# EAGLE schematic WPSU (EAGLE 9.4.2)

## Sheet 1 of 6: Battery
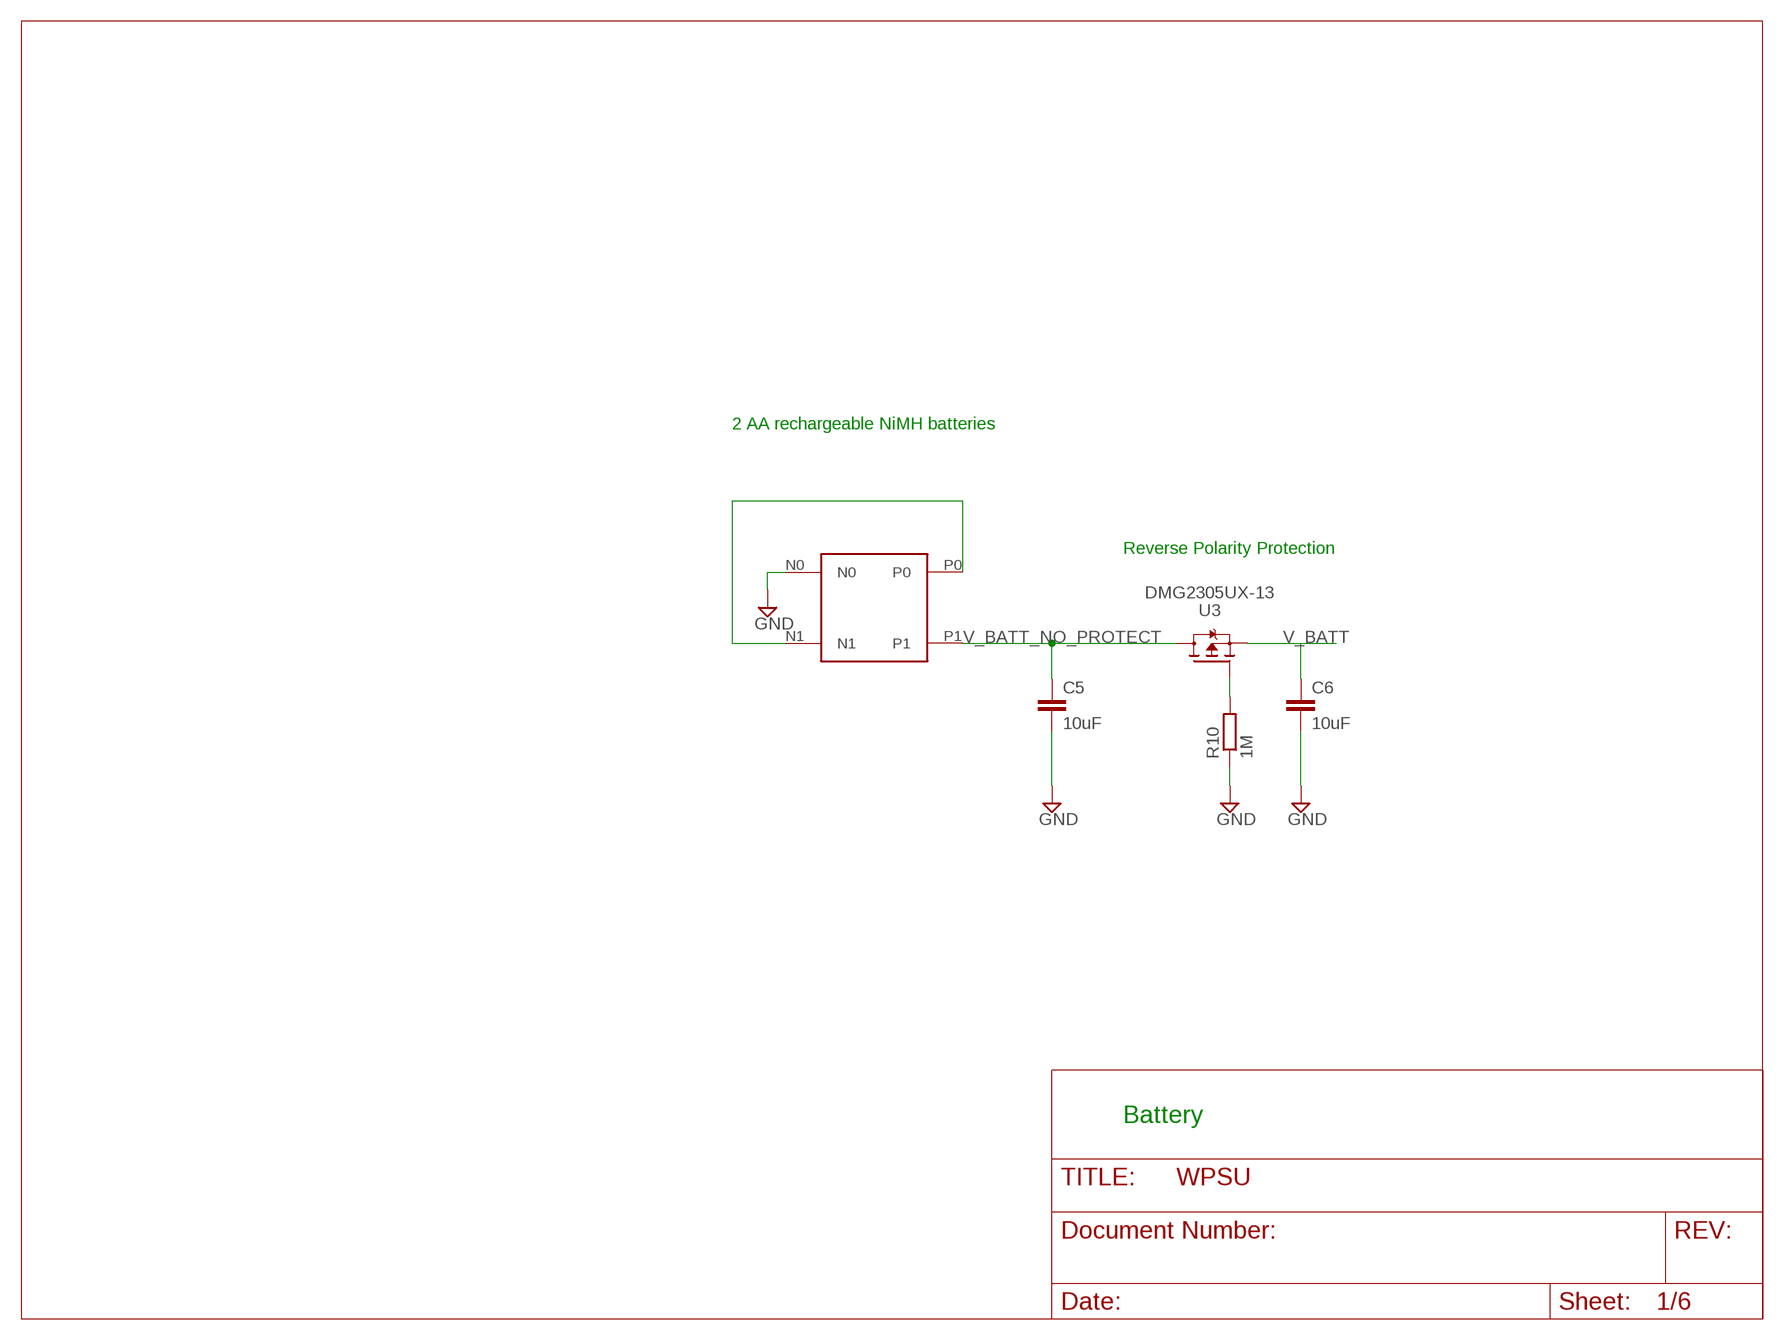
[diagram p0: schematic, sheet 1]

### Parts
C5  10uF  C-EUC0603  [C0603]
C6  10uF  C-EUC0603  [C0603]
R10  1M  R-EU_R0603  [R0603]
U3  DMG2305UX-13  [SOT-23]
U$1  2AA-BATTERY-HOLDER  [2AA-BATTERY-HOLDER-FOOTPRINT]

### Nets
GND: C5.2 C6.2 R10.1 U$1.N0 ; also sheet 2,3,4,5,6
N$7: U$1.N1 U$1.P0
N$8: R10.2 U3.1(G)
V_BATT: U3.2(S) ; also sheet 3
V_BATT_NO_PROTECT: C5.1 U3.3(D) U$1.P1
V_BATT_NO_PROTECT1: C6.1

### Notes on the sheet
- 2 AA rechargeable NiMH batteries
- Reverse Polarity Protection
- Battery

## Sheet 2 of 6: USB
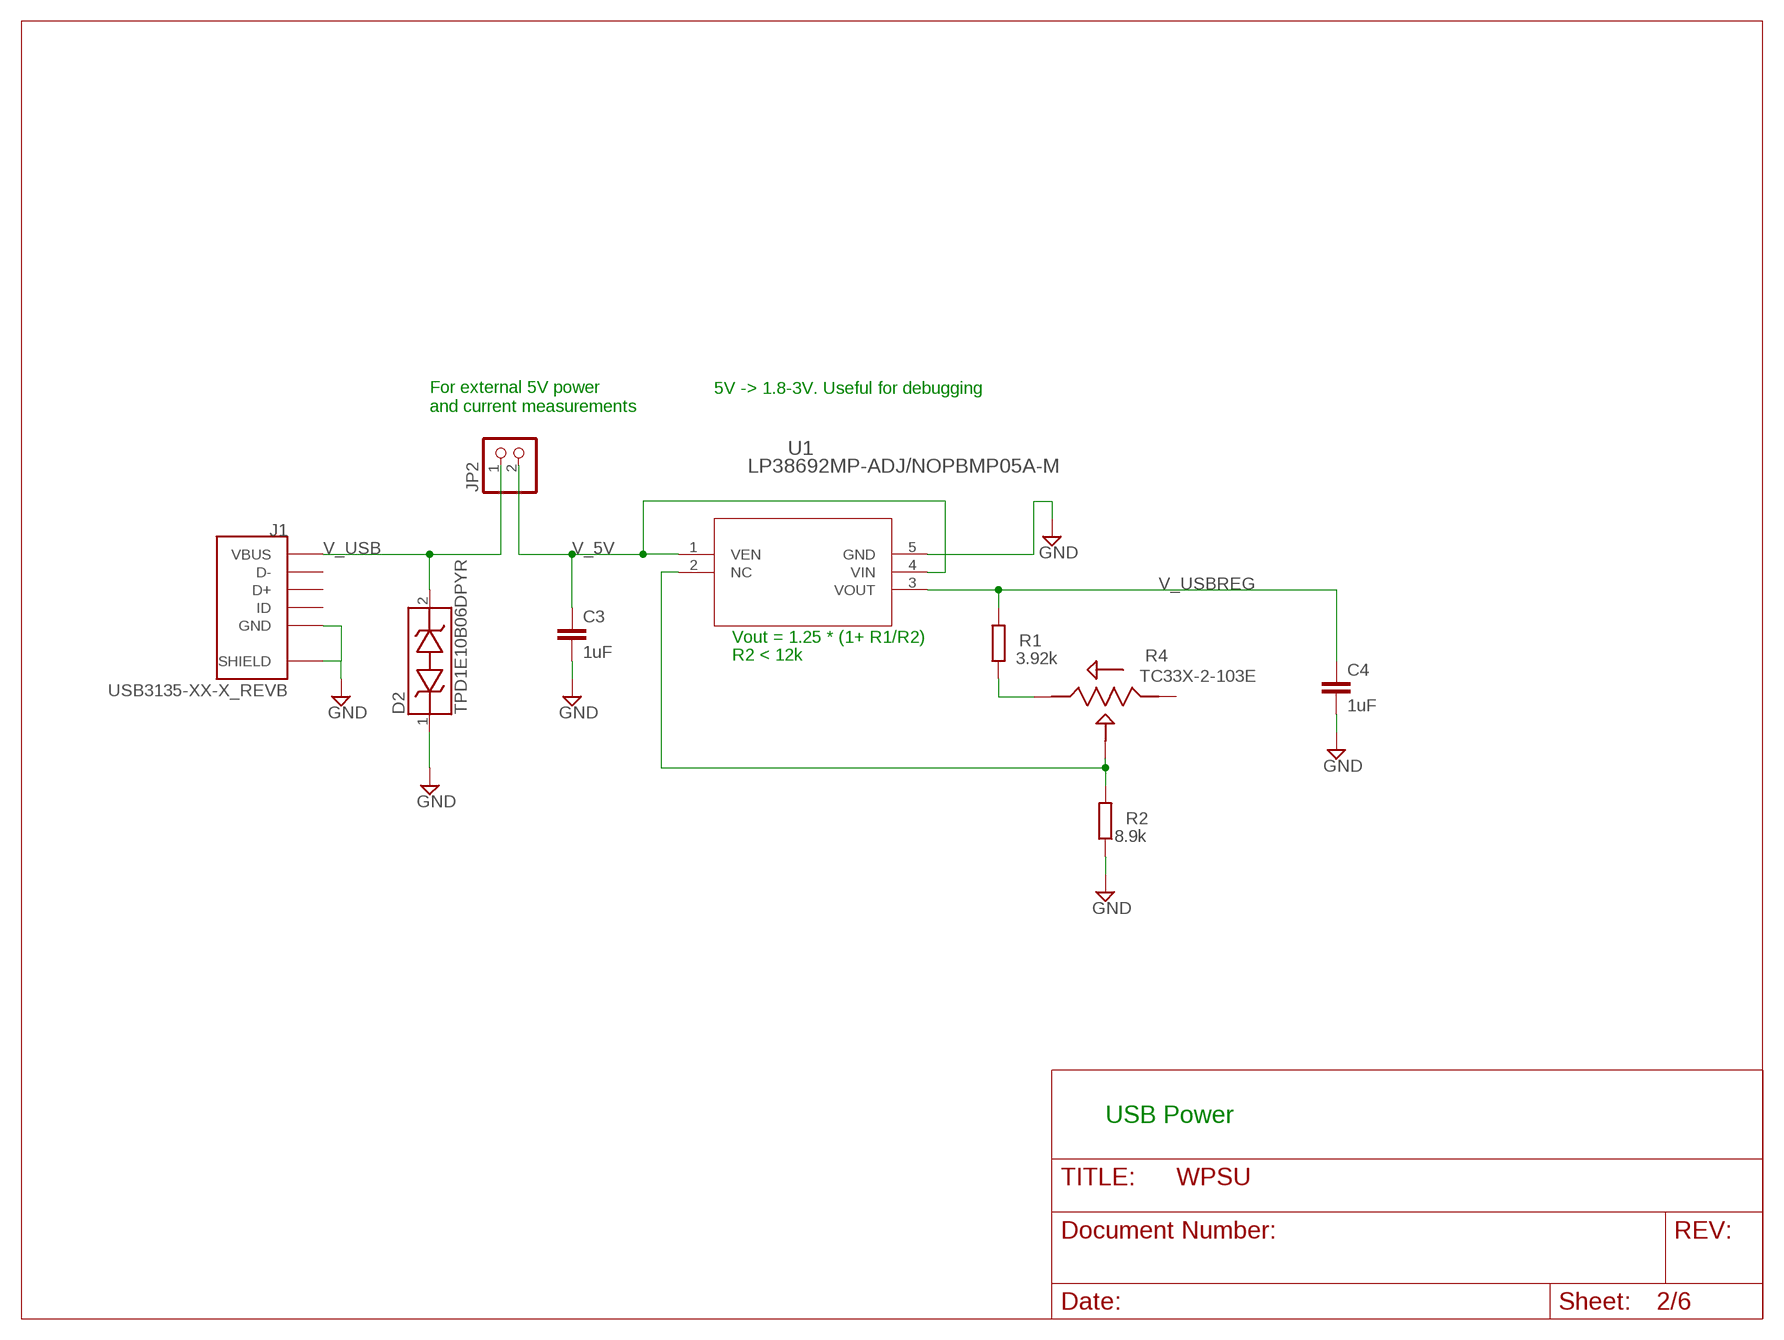
[diagram p1: schematic, sheet 2]

### Parts
C3  1uF  C-EUC0603  [C0603]
C4  1uF  C-EUC0603  [C0603]
D2  TPD1E10B06DPYR  [DIODFN100X60X45-2N]
J1  USB3135-XX-X_REVB  [GCT_USB3135-XX-X_REVB]
JP2  PINHD-1X2  [1X02]
R1  3.92k  R-EU_R0603  [R0603]
R2  8.9k  R-EU_R0603  [R0603]
R4  TC33X-2-103E  [35WR]
U1  LP38692MP-ADJ/NOPBMP05A-M  [MP05A-M]

### Nets
GND: C3.2 C4.2 D2.1 R2.1 U1.5(GND) ; also sheet 1,3,4,5,6
N$1: R2.2 R4.2 U1.2(NC)
N$2: R1.1 R4.3
N$5: J1.5(GND) J1.6(SHIELD) J1.7(SHIELD) J1.8(SHIELD) J1.9(SHIELD) ; supply symbol labelled GND
V_5V: C3.1 JP2.2 U1.1(VEN) U1.4(VIN)
V_USB: D2.2 J1.1(VBUS) JP2.1
V_USBREG: C4.1 R1.2 U1.3(VOUT) ; also sheet 3
Unconnected: J1.2(D-) J1.3(D+) J1.4(ID) R4.1

### Notes on the sheet
- 5V -> 1.8-3V. Useful for debugging
- For external 5V power
  and current measurements
- Vout = 1.25 * (1+ R1/R2)
- R2 < 12k
- USB Power

## Sheet 3 of 6: Power Regulation
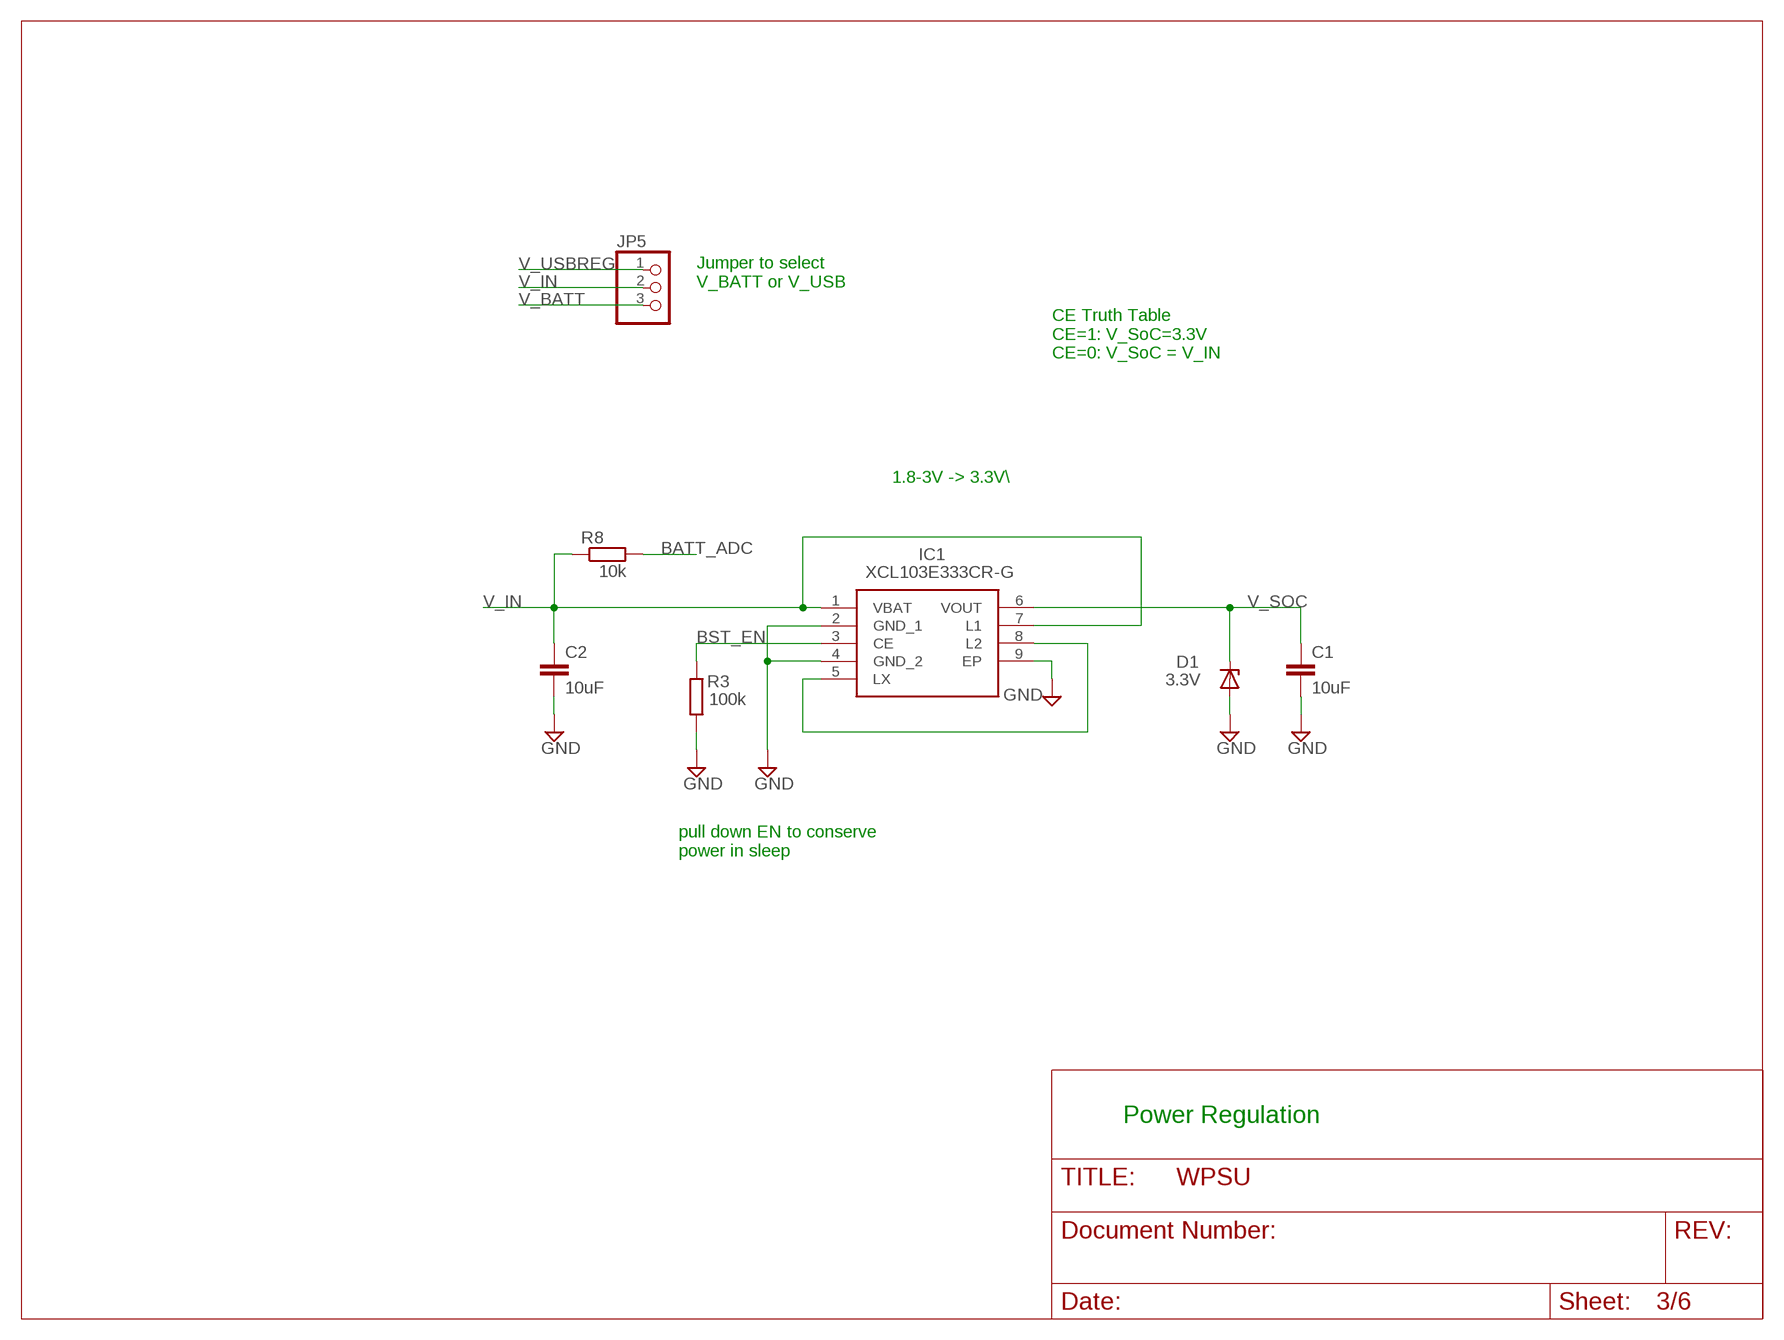
[diagram p2: schematic, sheet 3]

### Parts
C1  10uF  C-EUC0603  [C0603]
C2  10uF  C-EUC0603  [C0603]
D1  3.3V  ZENER-DIODESOT23  [SOT23]
IC1  XCL103E333CR-G  [XCL103D503CRG]
JP5  PINHD-1X3  [1X03]
R3  100k  R-EU_R0603  [R0603]
R8  10k  R-EU_R0603  [R0603]

### Nets
BATT_ADC: R8.2 ; also sheet 4
BST_EN: IC1.3(CE) R3.1 ; also sheet 4
GND: C1.2 C2.2 D1.1(A) IC1.2(GND_1) IC1.4(GND_2) IC1.9(EP) R3.2 ; also sheet 1,2,4,5,6
N$3: IC1.5(LX) IC1.8(L2)
V_BATT: JP5.3 ; also sheet 1
V_IN: C2.1 IC1.1(VBAT) IC1.7(L1) JP5.2 R8.1
V_SOC: C1.1 D1.3(C) IC1.6(VOUT) ; also sheet 4,5,6
V_USBREG: JP5.1 ; also sheet 2

### Notes on the sheet
- Jumper to select
  V_BATT or V_USB
- CE Truth Table
  CE=1: V_SoC=3.3V
  CE=0: V_SoC = V_IN
- 1.8-3V -> 3.3V\
- pull down EN to conserve 
  power in sleep
- Power Regulation

## Sheet 4 of 6: SoC Headers
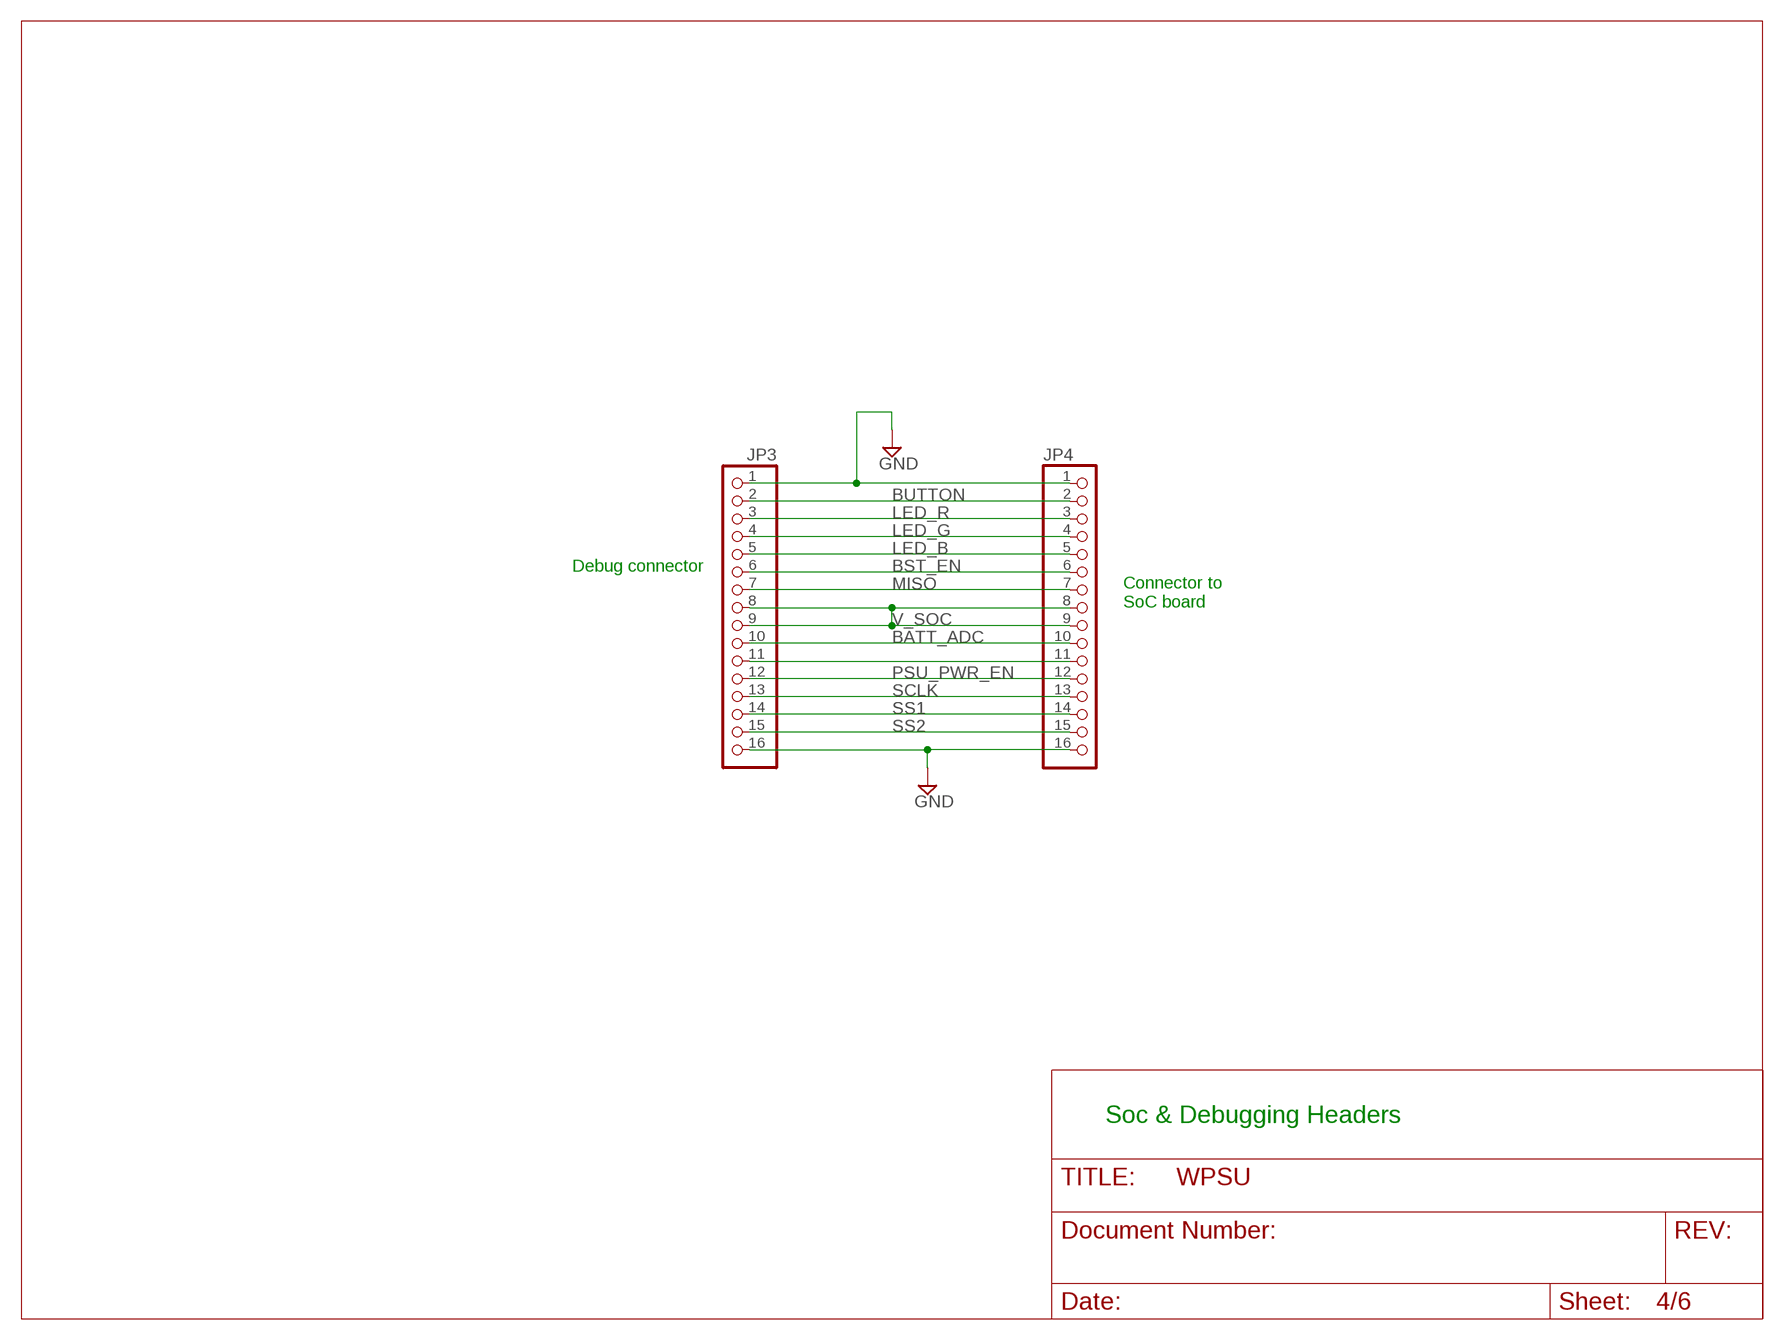
[diagram p3: schematic, sheet 4]

### Parts
JP3  PINHD-1X16  [1X16]
JP4  PINHD-1X16  [1X16]

### Nets
BATT_ADC: JP3.10 JP4.10 ; also sheet 3
BST_EN: JP3.6 JP4.6 ; also sheet 3
BUTTON: JP3.2 JP4.2 ; also sheet 5
GND: JP3.1 JP4.1 ; also sheet 1,2,3,5,6
LED_B: JP3.5 JP4.5 ; also sheet 5
LED_G: JP3.4 JP4.4 ; also sheet 5
LED_R: JP3.3 JP4.3 ; also sheet 5
MISO: JP3.7 JP4.7 ; also sheet 6
N$4: JP3.11 JP4.11
N$16: JP3.16 JP4.16 ; supply symbol labelled GND
PSU_PWR_EN: JP3.12 JP4.12 ; also sheet 6
SCLK: JP3.13 JP4.13 ; also sheet 6
SS1: JP3.14 JP4.14 ; also sheet 6
SS2: JP3.15 JP4.15 ; also sheet 6
V_SOC: JP3.8 JP3.9 JP4.8 JP4.9 ; also sheet 3,5,6

### Notes on the sheet
- Debug connector
- Connector to
  SoC board
- Soc & Debugging Headers

## Sheet 5 of 6: Misc
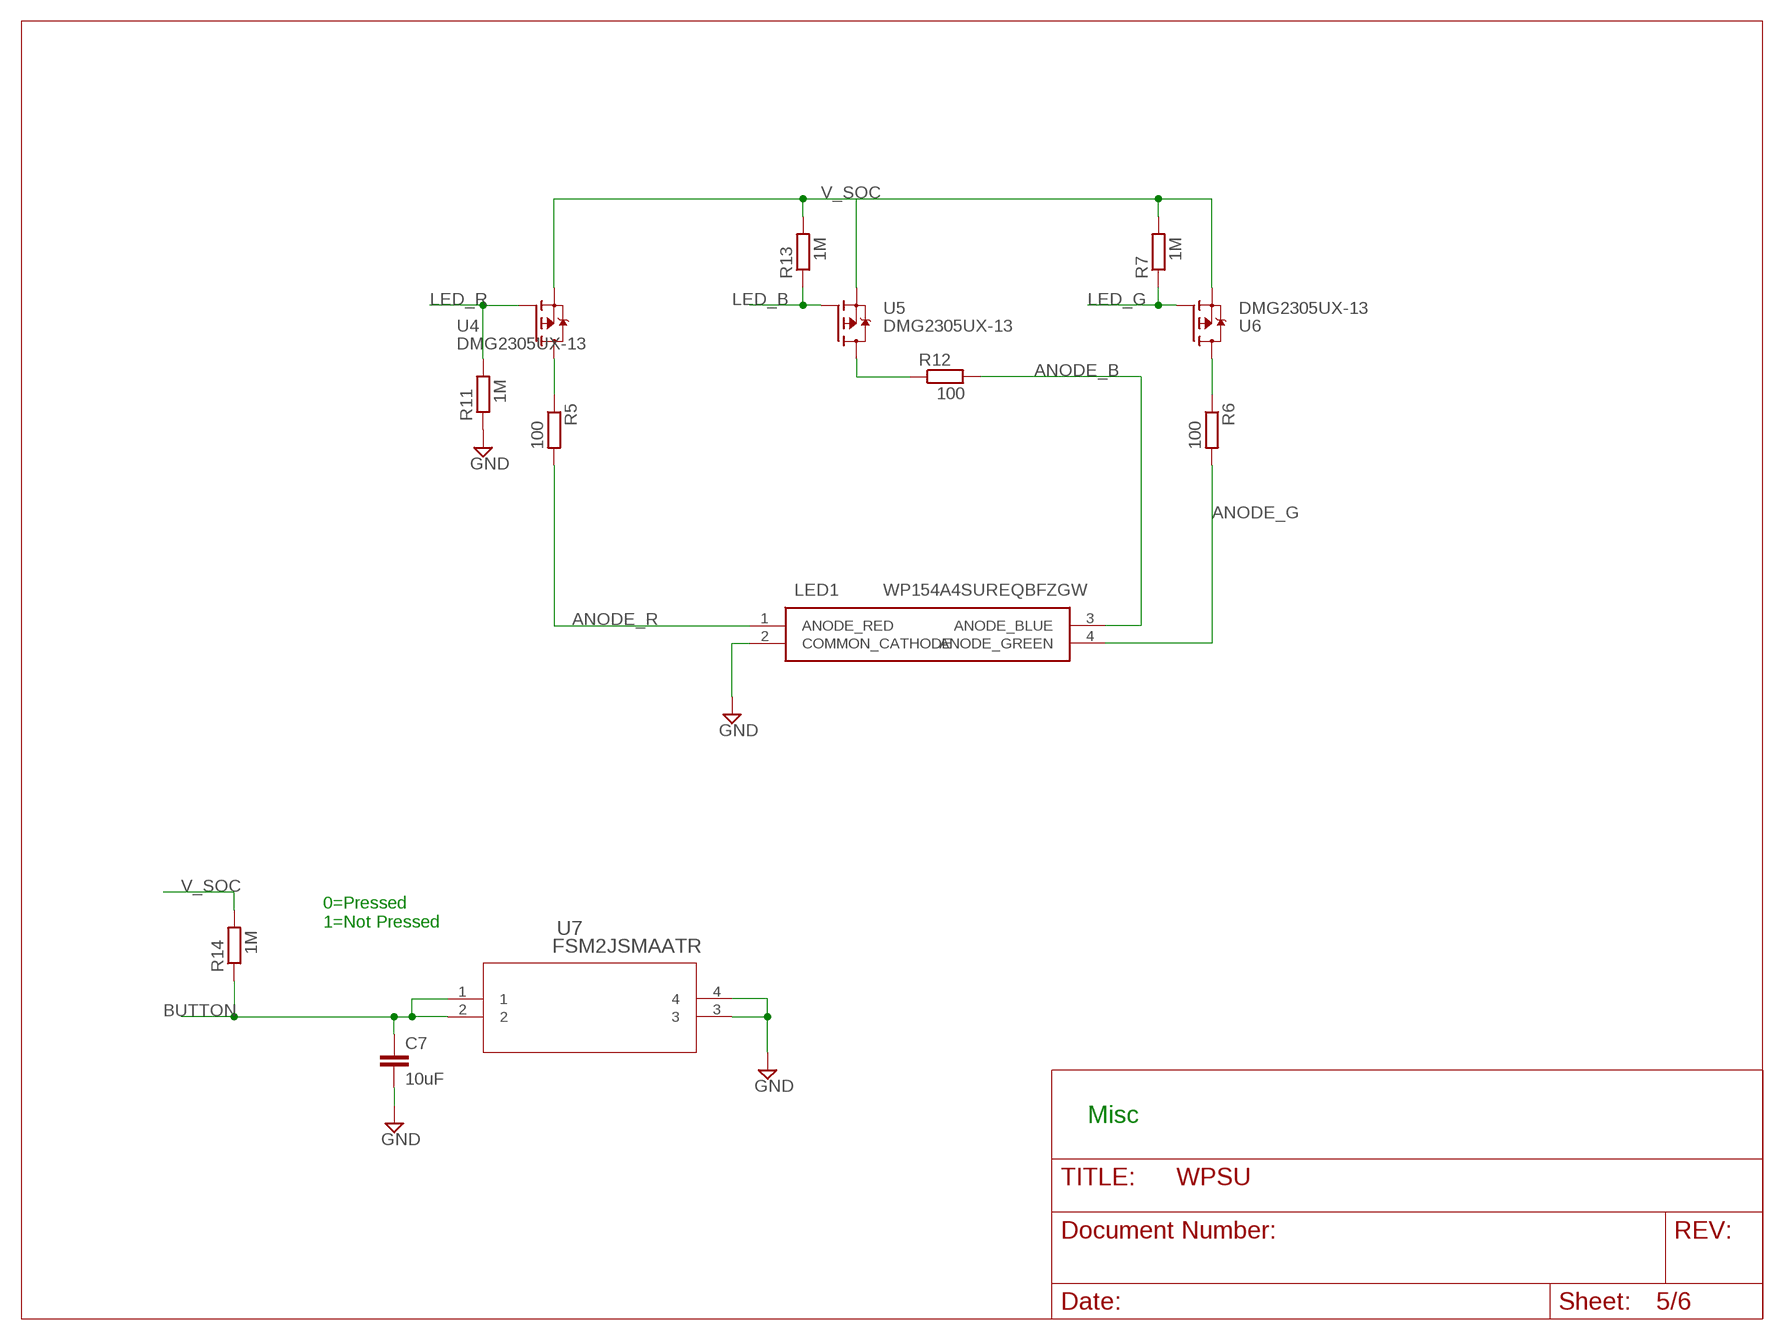
[diagram p4: schematic, sheet 5]

### Parts
C7  10uF  C-EUC0603  [C0603]
LED1  WP154A4SUREQBFZGW  [L-154A4SUREQBFZGEC]
R5  100  R-EU_R0603  [R0603]
R6  100  R-EU_R0603  [R0603]
R7  1M  R-EU_R0603  [R0603]
R11  1M  R-EU_R0603  [R0603]
R12  100  R-EU_R0603  [R0603]
R13  1M  R-EU_R0603  [R0603]
R14  1M  R-EU_R0603  [R0603]
U4  DMG2305UX-13  [SOT-23]
U5  DMG2305UX-13  [SOT-23]
U6  DMG2305UX-13  [SOT-23]
U7  FSM2JSMAATR  [SWITCH_FSM2JSMAA]

### Nets
ANODE_B: LED1.3(ANODE_BLUE) R12.2
ANODE_G: LED1.4(ANODE_GREEN) R6.2
ANODE_R: LED1.1(ANODE_RED) R5.2
BUTTON: C7.1 R14.1 U7.1 U7.2 ; also sheet 4
GND: C7.2 LED1.2(COMMON_CATHODE) R11.1 U7.3 U7.4 ; also sheet 1,2,3,4,6
LED_B: R13.1 U5.1(G) ; also sheet 4
LED_G: R7.1 U6.1(G) ; also sheet 4
LED_R: R11.2 U4.1(G) ; also sheet 4
N$10: R6.1 U6.3(D)
N$12: R5.1 U4.3(D)
N$14: R12.1 U5.3(D)
V_SOC: R7.2 R13.2 R14.2 U4.2(S) U5.2(S) U6.2(S) ; also sheet 3,4,6

### Notes on the sheet
- 0=Pressed
  1=Not Pressed
- Misc

## Sheet 6 of 6: Pressure Sensors
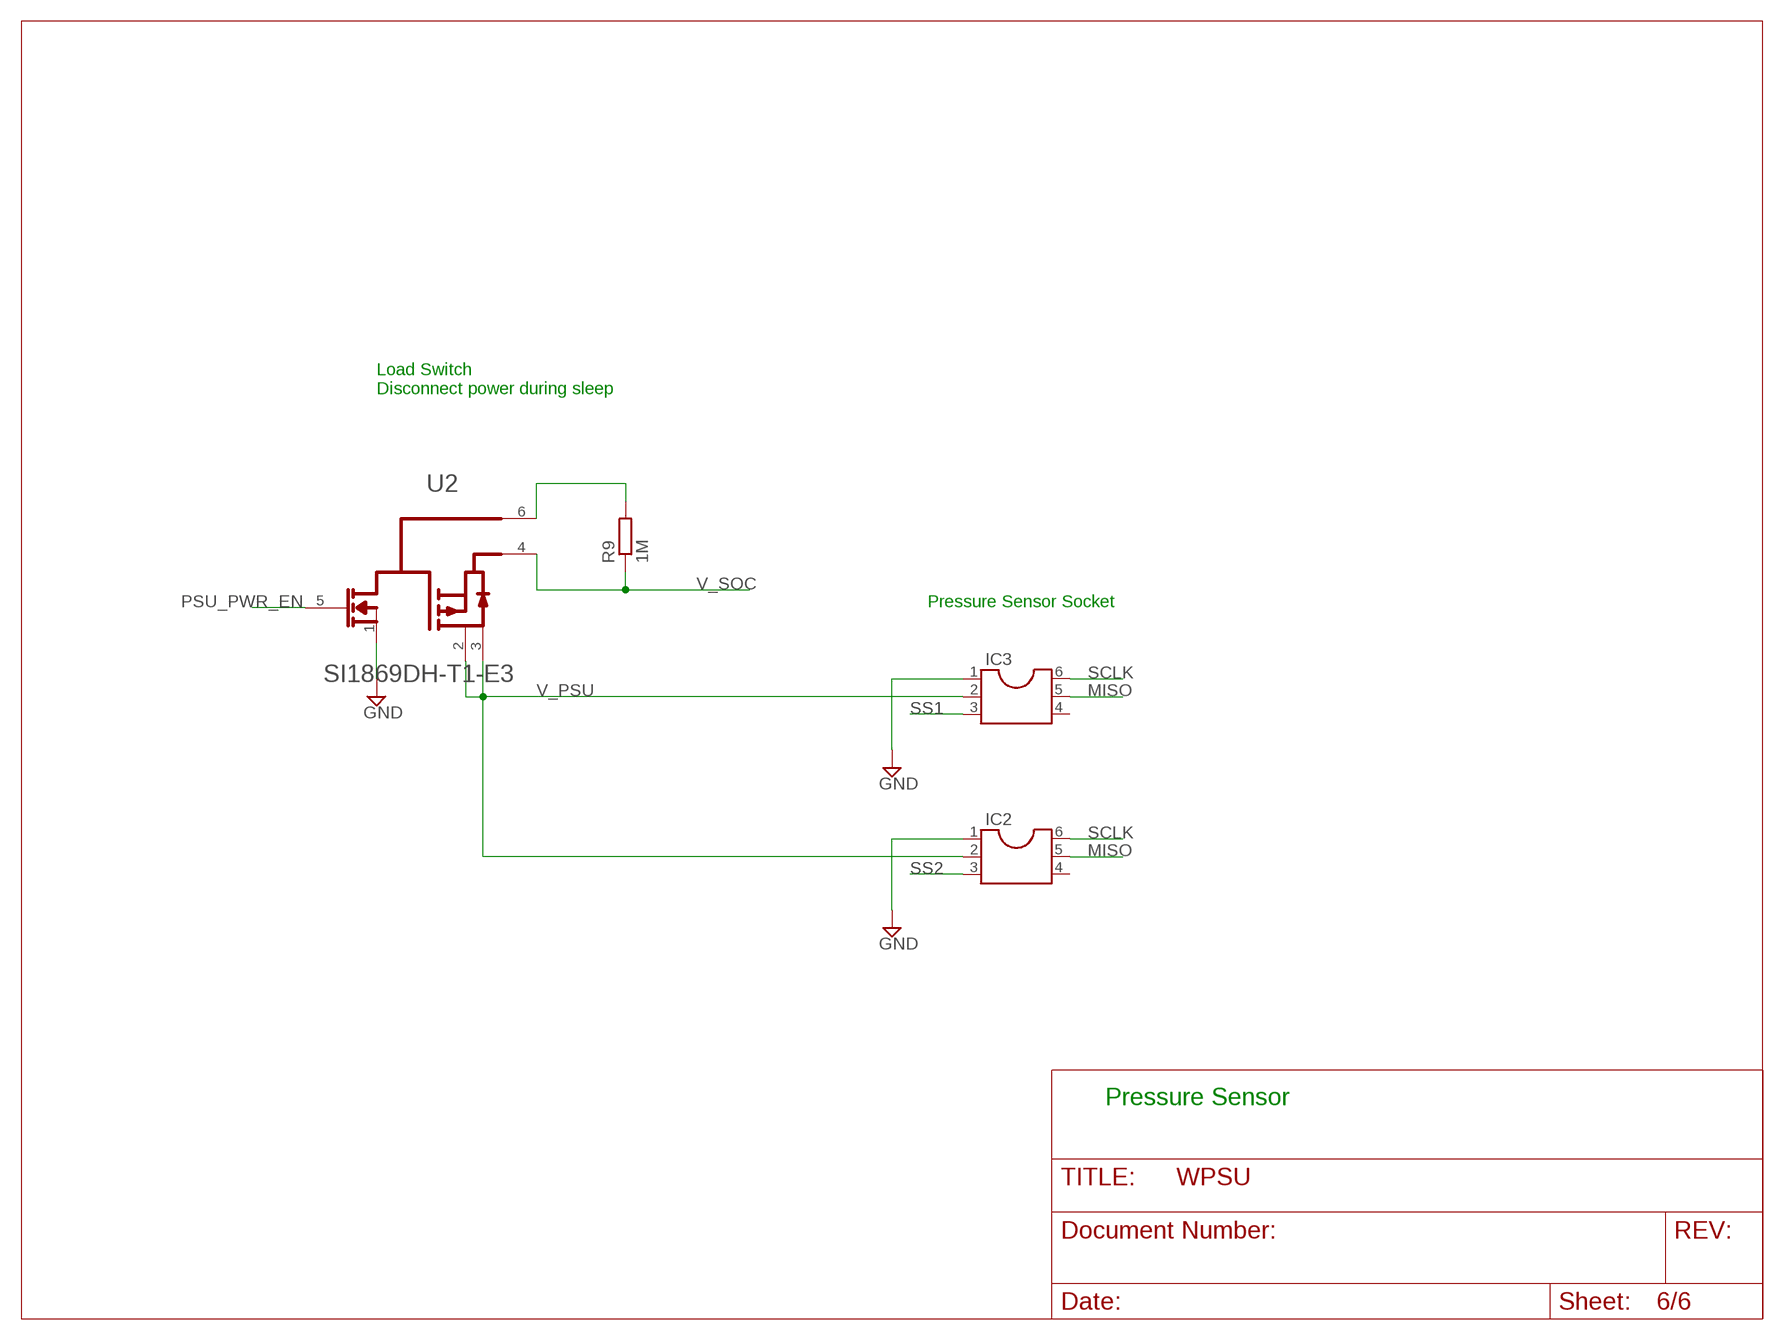
[diagram p5: schematic, sheet 6]

### Parts
IC2  DIL6  [DIL06]
IC3  DIL6  [DIL06]
R9  1M  R-EU_R0603  [R0603]
U2  VISHAY_SI1869DH-T1-E3VISHAY_SI1869DH-T1-E3_0_0  [VISHAY_SI1869DH-T1-E3_0]

### Nets
GND: IC2.1 IC3.1 U2.1(R2) ; also sheet 1,2,3,4,5
MISO: IC2.5 IC3.5 ; also sheet 4
N$9: R9.2 U2.6(R1/C1)
PSU_PWR_EN: U2.5(ON/OFF) ; also sheet 4
SCLK: IC2.6 IC3.6 ; also sheet 4
SS1: IC3.3 ; also sheet 4
SS2: IC2.3 ; also sheet 4
V_PSU: IC2.2 IC3.2 U2.2(1_D2) U2.3(2_D2)
V_SOC: R9.1 U2.4(S2) ; also sheet 3,4,5
Unconnected: IC2.4 IC3.4

### Notes on the sheet
- Load Switch
  Disconnect power during sleep
- Pressure Sensor Socket
- Pressure Sensor

## Library data of the parts
C1-C7 = rcl:C-EU: CAPACITOR, European symbol; SPICEPREFIX: C
D1 = diode:ZENER-DIODE: Z-Diode; DIGI-KEY_PART_NUMBER: BZX84C3V3LT1GOSCT-ND
D2 = TPD1E10B06DPYR:TPD1E10B06DPYR: Single Channel ESD in 0402 package with 10pF Capacitance and 6V Breakdown 2-X1SON -40 to 125; DESCRIPTION: Single Channel ESD in 0402 package with 10pF Capacitance and 6V Breakdown 2-X1SON -40 to 125; DIGI-KEY_PART_NUMBER: 296-30406-1-ND; DIGI-KEY_PURCHASE_URL: https://www.digikey.com/product-detail/en/texas-instruments/TPD1E10B06DPYR/296-30406-1-ND/3283560?utm_source=snapeda&utm_medium=aggregator&utm_campaign=symbol; MF: Texas Instruments; MP: TPD1E10B06DPYR; PACKAGE: XDFN-2 Texas Instruments
IC1 = SamacSys_Parts:XCL103E333CR-G: Switching Voltage Regulators Inductor Built-in Step-Up micro DCDC converter PWM/PFM Automatic Switch Control Source: Datasheet <https://www.torexsemi.com/file/xcl102/XCL102-103.pdf>; DESCRIPTION: Switching Voltage Regulators Inductor Built-in Step-Up micro DCDC converter PWM/PFM Automatic Switch Control; HEIGHT: 1.04mm; MANUFACTURER_NAME: Torex; MANUFACTURER_PART_NUMBER: XCL103E333CR-G; MOUSER_PART_NUMBER: 865-XCL103E333CR-G; MOUSER_PRICE-STOCK: https://www.mouser.com/Search/Refine.aspx?Keyword=865-XCL103E333CR-G
IC2 IC3 = ic-package:DIL6: Dual In Line / Socket
J1 = USB3135-XX-X_REVB:USB3135-XX-X_REVB: Micro USB Receptacle, Type B, SMT, Horizontal, Top (Reverse) Mount, without Peg; AVAILABILITY: Unavailable; DESCRIPTION: USB3100 Series 5 Pin SMT Right Angle Top Mount Micro USB Receptacle w/ Peg; DIGI-KEY_PART_NUMBER: 2073-USB3135-30-ACT-ND; MF: Global Connector Technology; MP: USB3135-30-A; PACKAGE: None; PRICE: None
JP2 = pinhead:PINHD-1X2: PIN HEADER
JP3 JP4 = pinhead:PINHD-1X16: PIN HEADER
JP5 = pinhead:PINHD-1X3: PIN HEADER
LED1 = SamacSys_Parts:WP154A4SUREQBFZGW: Standard LEDs - Through Hole 5MM FULL COLOR LED Source: Datasheet <https://componentsearchengine.com/Datasheets/1/WP154A4SUREQBFZGW.pdf>; DESCRIPTION: Standard LEDs - Through Hole 5MM FULL COLOR LED; HEIGHT: mm; MANUFACTURER_NAME: Kingbright; MANUFACTURER_PART_NUMBER: WP154A4SUREQBFZGW; MOUSER_PART_NUMBER: 604-WP154A4SUREQBFZW; MOUSER_PRICE-STOCK: https://www.mouser.com/Search/Refine.aspx?Keyword=604-WP154A4SUREQBFZW
R1 = rcl:R-EU_: RESISTOR, European symbol; DIGI-KEY_PART_NUMBER: 749-1646-2-ND; SPICEPREFIX: R
R2 = rcl:R-EU_: RESISTOR, European symbol; DIGI-KEY_PART_NUMBER: P9.09KDBCT-ND; SPICEPREFIX: R
R3 R10 = rcl:R-EU_: RESISTOR, European symbol; SPICEPREFIX: R
R4 = TC33X-2-103E:TC33X-2-103E: http://octopart.com/tc33x-2-103e-bourns-68150; DESCRIPTION: Res Trimmer 10K Ohm 25% 0.1W_1/10W_ 1_Elec_/1_Mech_Turn _3 X 3.8mm_ Foot Print SMD Embossed T/R; DIGI-KEY_PART_NUMBER: TC33X-103ECT-ND; DIGI-KEY_PURCHASE_URL: https://www.digikey.com/product-detail/en/bourns-inc/TC33X-2-103E/TC33X-103ECT-ND/612911?utm_source=snapeda&utm_medium=aggregator&utm_campaign=symbol; MF: Bourns; MP: TC33X-2-103E; PACKAGE: Bourns
R5-R9 R11-R14 = resistor:R-EU_: RESISTOR, European symbol
U1 = custom:LP38692MP-ADJ/NOPB: IC REG LIN POS ADJ 1A SOT223-5; DATASHEET: https://www.ti.com/lit/ds/symlink/lp38690-adj.pdf; MANUFACTURER_PART_NUMBER: LP38692MPADJNOPB; VENDOR: Texas Instruments
U2 = Vishay - SI1869DH-T1-E3:VISHAY_SI1869DH-T1-E3: NPN/PNP MOSFET, 20V, SC-70; CENTROID_NOT_SPECIFIED: No; DATASHEET: http://www.vishay.com/docs/73449/si1869dh.pdf; DEVICE_CLASS_L1: Integrated Circuits (ICs); DEVICE_CLASS_L2: Power Management ICs; DEVICE_CLASS_L3: Hot Swap Controllers; DIGIKEY_DESCRIPTION: IC LOAD SW LVL SHIFT 20V SC70-6; DIGIKEY_PART_NUMBER: SI1869DH-T1-E3CT-ND; HEIGHT: 1.1mm; LEAD_FREE: yes; MAX_JUNCTION_TEMP: +150°C; MAX_POWER_DISSIPATION: 1W; MF: Vishay; MFG_PACKAGE_IDENT: S18-0276; MFG_PACKAGE_IDENT_DATE: 03/2018; MFG_PACKAGE_IDENT_REV: D; MOUSER_DESCRIPTION: MOSFET LOAD SWITCH 1.8V RA W/ LEVEL SHIFT; MOUSER_PART_NUMBER: 781-SI1869DH-T1-E3; MPN: SI1869DH-T1-E3; NUMBER_OF_OUTPUTS: 1; PACKAGE: SOT363; PREFIX: U; ROHS: yes; TEMPERATURE_RANGE_HIGH: +150°C; TEMPERATURE_RANGE_LOW: -55°C; VERIFICATION_VERSION: 0.0.0.1
U3-U6 = custom:DMG2305UX-13; MANUFACTURER_PART_NUMBER: DMG2305UX13; VENDOR: Diodes Inc
U7 = custom:FSM2JSMAATR; DIGI-KEY_PART_NUMBER: 450-1792-1-ND; MANUFACTURER_PART_NUMBER: FSM2JSMAATR; VENDOR: TE Connectivity
U$1 = custom:2AA-BATTERY-HOLDER; DIGI-KEY_PART_NUMBER: 36-1013-ND